# EAGLE design sandh (EAGLE 7.7.0)
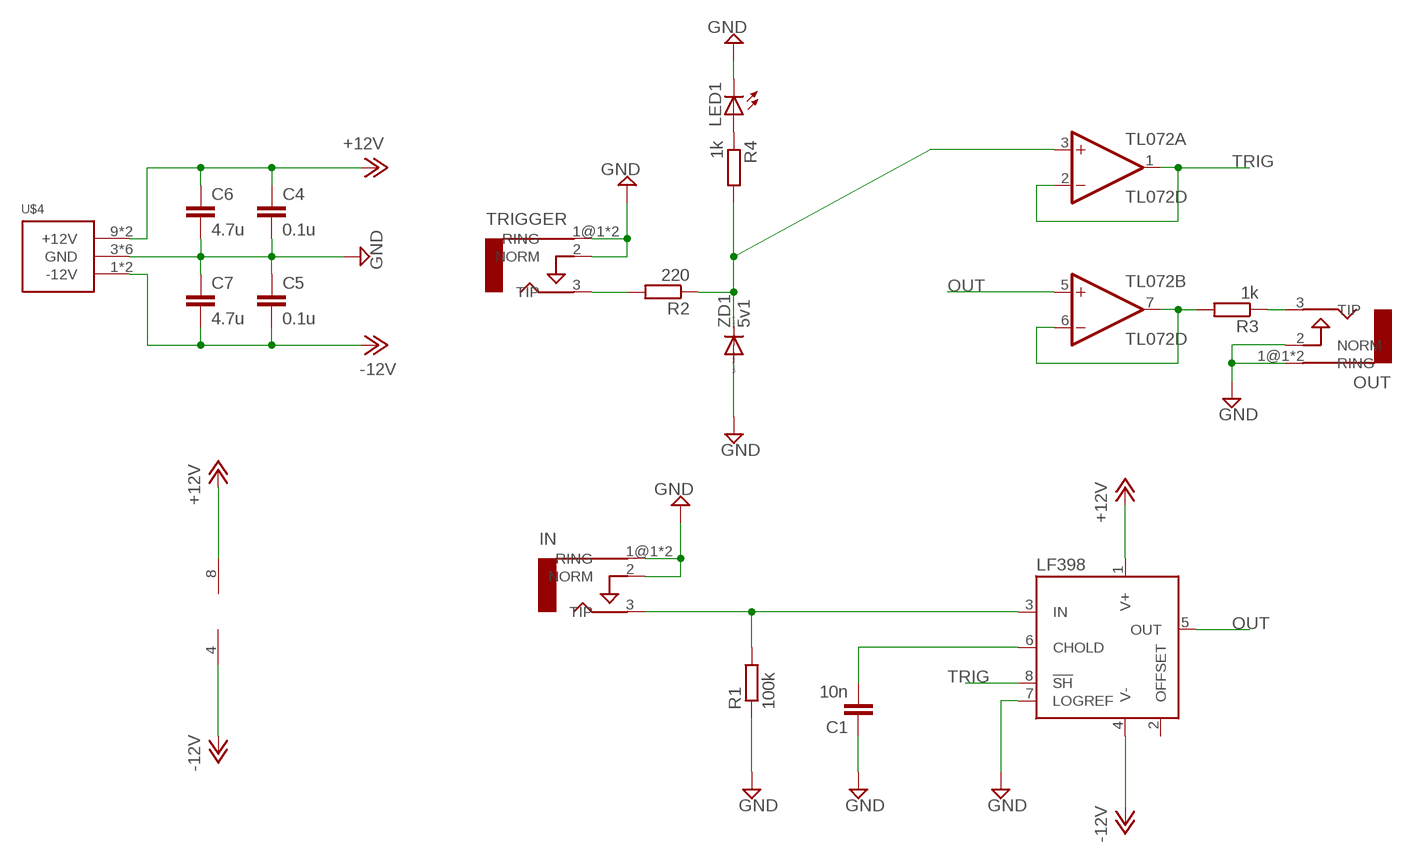
[diagram p0: schematic, sheet 1]

## Parts
C1  10n  C-EUC0805  [C0805]
C4  0.1u  C-EUC0805  [C0805]
C5  0.1u  C-EUC0805  [C0805]
C6  4.7u  C-EUC0805  [C0805]
C7  4.7u  C-EUC0805  [C0805]
IN  AUDIO-JACKERTHENVAR  [ERTHENVAR-JACK]
LED1  LEDCHIP-LED0805  [CHIP-LED0805]
LF398  LF398AD  [SO08]
OUT  AUDIO-JACKERTHENVAR  [ERTHENVAR-JACK]
R1  100k  R-EU_R0805  [R0805]
R2  220  R-EU_R0805  [R0805]
R3  1k  R-EU_R0805  [R0805]
R4  1k  R-EU_R0805  [R0805]
TL072  TL072D  [SO08]
TRIGGER  AUDIO-JACKERTHENVAR  [ERTHENVAR-JACK]
U$4  POWER_SIMPLE10  [POWER_10]
ZD1  5v1  DIODE-SOD323-W  [SOD323-W]

## Nets
+12V: C4.1 C6.1 LF398.1(V+) TL072.8(P:V+) U$4.9(+12V) U$4.10(+12V)
-12V: C5.2 C7.2 LF398.4(V-) TL072.4(P:V-) U$4.1(-12V) U$4.2(-12V)
GND: C1.1 C4.2 C5.1 C6.2 C7.1 IN.1@1(RING) IN.1@2(RING) IN.2(NORM) LED1.C LF398.7(LOGREF) OUT.1@1(RING) OUT.1@2(RING) OUT.2(NORM) R1.1 TRIGGER.1@1(RING) TRIGGER.1@2(RING) TRIGGER.2(NORM) U$4.3(GND) U$4.4(GND) U$4.5(GND) U$4.6(GND) U$4.7(GND) U$4.8(GND) ZD1.A
N$1: IN.3(TIP) LF398.3(IN) R1.2
N$2: C1.2 LF398.6(CHOLD)
N$3: LED1.A R4.1
N$4: R2.2 TRIGGER.3(TIP)
N$5: R3.2 TL072.6(B:-IN) TL072.7(B:OUT)
N$7: OUT.3(TIP) R3.1
OUT: LF398.5(OUT) TL072.5(B:+IN)
TRIG: LF398.8(!SH) R2.1 R4.2 TL072.1(A:OUT) TL072.2(A:-IN) TL072.3(A:+IN) ZD1.C
Unconnected: LF398.2(OFFSET)

## Library data of the parts
C1 C4-C7 = rcl:C-EU: CAPACITOR, European symbol
IN OUT TRIGGER = erthenvar:AUDIO-JACK: Switching Mono 3.5mm Audio Jack from Erthenvar.
LED1 = led:LED: LED OSRAM: - CHIPLED LG R971, LG N971, LY N971, LG Q971, LY Q971, LO R971, LY R971 LH N974, LH R974 LS Q976, LO Q976, LY Q976 LO Q996 - Hyper CHIPLED LW Q18S LB Q993, LB Q99A, LB R99A - SideLED LS A670, LO A670, LY A670, LG A670, LP A670 LB A673, LV A673, LT A673, LW A673 LH A674 LY A675 LS A676, LA A676, LO A676, LY A676, LW A676 LS A679, LY A679, LG A679 - Hyper Micro SIDELED® LS Y876, LA Y876, LO Y876, LY Y876 LT Y87S - SmartLED LW L88C, LW L88S LB L89C, LB L89S, LG L890 LS L89K, LO L89K, LY L89K LS L896, LA L896, LO L896, LY L896 - TOPLED LS T670, LO T670, LY T670, LG T670, LP T670 LSG T670, LSP T670, LSY T670, LOP T670, LYG T670 LG T671, LOG T671, LSG T671 LB T673, LV T673, LT T673, LW T673 LH T674 LS T676, LA T676, LO T676, LY T676, LB T676, LH T676, LSB T676, LW T676 LB T67C, LV T67C, LT T67C, LS T67K, LO T67K, LY T67K, LW E67C LS E67B, LA E67B, LO E67B, LY E67B, LB E67C, LV E67C, LT E67C LW T67C LS T679, LY T679, LG T679 LS T770, LO T770, LY T770, LG T770, LP T770 LB T773, LV T773, LT T773, LW T773 LH T774 LS E675, LA E675, LY E675, LS T675 LS T776, LA T776, LO T776, LY T776, LB T776 LHGB T686 LT T68C, LB T68C - Hyper Mini TOPLED® LB M676 - Mini TOPLED Santana® LG M470 LS M47K, LO M47K, LY M47K Source: http://www.osram.convergy.de LUXEON: - LUMILED® LXK2-PW12-R00, LXK2-PW12-S00, LXK2-PW14-U00, LXK2-PW14-V00 LXK2-PM12-R00, LXK2-PM12-S00, LXK2-PM14-U00 LXK2-PE12-Q00, LXK2-PE12-R00, LXK2-PE12-S00, LXK2-PE14-T00, LXK2-PE14-U00 LXK2-PB12-K00, LXK2-PB12-L00, LXK2-PB12-M00, LXK2-PB14-N00, LXK2-PB14-P00, LXK2-PB14-Q00 LXK2-PR12-L00, LXK2-PR12-M00, LXK2-PR14-Q00, LXK2-PR14-R00 LXK2-PD12-Q00, LXK2-PD12-R00, LXK2-PD12-S00 LXK2-PH12-R00, LXK2-PH12-S00 LXK2-PL12-P00, LXK2-PL12-Q00, LXK2-PL12-R00 Source: www.luxeon.com KINGBRIGHT: KA-3528ASYC Source: www.kingbright.com
LF398 = linear:LF398A: SAMPLE&HOLD AMPLIFIER
R1-R4 = rcl:R-EU_: RESISTOR, European symbol
TL072 = linear:TL072: OP AMP
U$4 = eurorack:POWER_SIMPLE
ZD1 = diode:DIODE-: DIODE

## Board
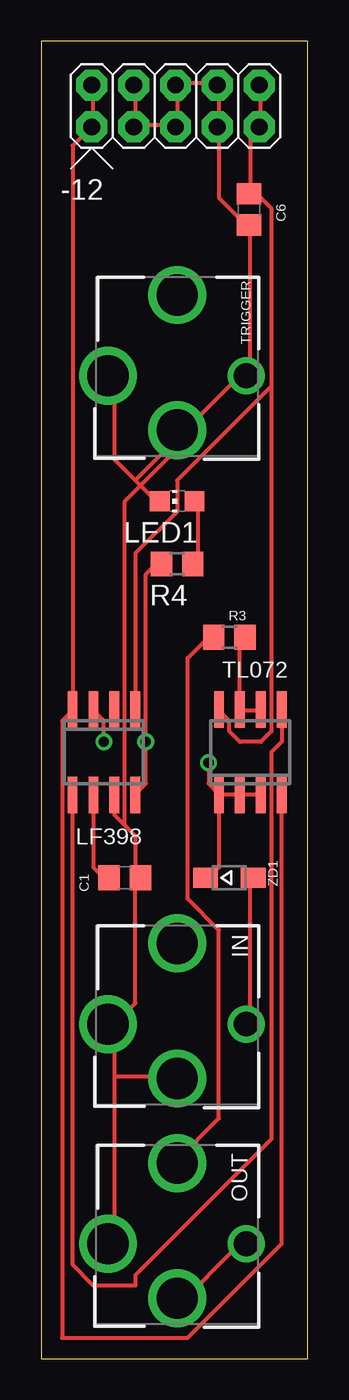
[diagram p1: board, top side]
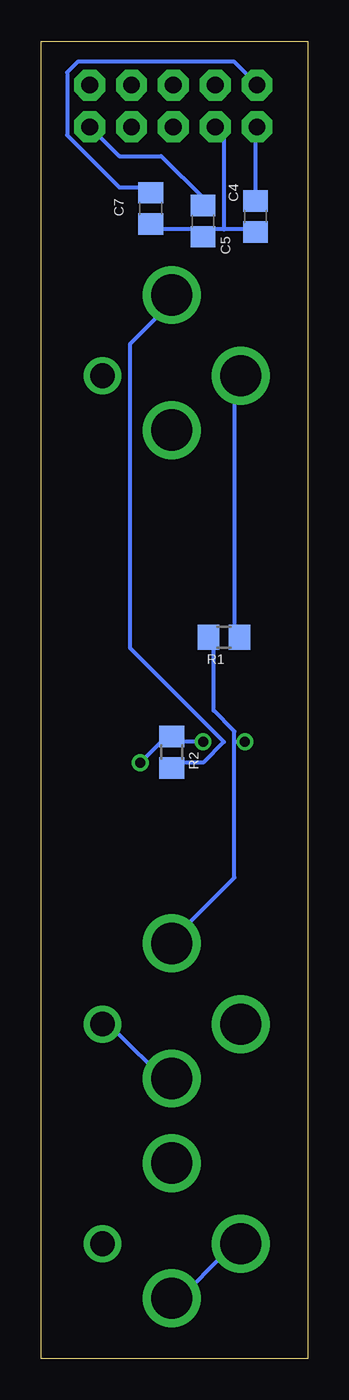
[diagram p2: board, bottom side, seen from below]

Size 16.18 x 80 mm. Coordinates in mm from the lower left corner, seen from the top.
Outline: 0,0 16.18,0 16.18,80 0,80 0,0
Copper layers (1*16): Top 0.035mm / dielectric 1.5mm / Bottom 0.035mm
Design rules "default": minimum track width 10mil, minimum drill 24mil, track to track 8mil, track to pad 8mil, pad to pad 8mil, via to via 8mil, smd to smd 8mil, copper to edge 40mil, drill to drill 8mil, minimum pad ring 10mil, minimum via ring 8mil, stop-mask expansion 4mil, vias tented up to drill 0mil, thermal gap 10mil

### Footprints (pad centres in the part's own frame; a part is rotated, then mirrored left to right if it is on the bottom)
C0805 = smd 1.3 x 1.5: 1 -0.95,0; 2 0.95,0
ERTHENVAR-JACK = drill 2.5: 1@1 -4.2,0; 2 0,-3.3; 3 0,4.9 | drill 1.5: 1@2 4.2,0
CHIP-LED0805 = smd 1.2 x 1.2: A 0,-1.05; C 0,1.05
SO08 = smd 0.6 x 2.2: 1 -1.905,-2.6; 2 -0.635,-2.6; 3 0.635,-2.6; 4 1.905,-2.6; 5 1.905,2.6; 6 0.635,2.6; 7 -0.635,2.6; 8 -1.905,2.6
R0805 = smd 1.3 x 1.5: 1 -0.95,0; 2 0.95,0
POWER_10 = drill 1.016 pad 1.88 octagon: 1 -5.08,-1.27; 2 -5.08,1.27; 3 -2.54,-1.27; 4 -2.54,1.27; 5 0,-1.27; 6 0,1.27; 7 2.54,-1.27; 8 2.54,1.27; 9 5.08,-1.27; 10 5.08,1.27
SOD323-W = smd 1.5 x 1.2: A 1.45,0; C -1.45,0

### Placement (x,y rotation side)
C1  5.08,29.21 180 top
C4  6.35,69.08 270 bottom
C5  3.17,69.35 90 bottom
C6  12.62,69.79 270 top
C7  9.53,69.85 90 bottom
IN  8.26,20.32 0 top
LED1  8.26,52.07 90 top
LF398  3.81,36.83 180 top
OUT  8.26,6.99 0 top
R1  5.08,43.81 180 bottom
R2  8.26,36.83 270 bottom
R3  11.43,43.81 0 top
R4  8.26,48.26 180 top
TL072  12.7,36.83 0 top
TRIGGER  8.26,59.69 0 top
U$4  8.16,76.07 0 top
ZD1  11.43,29.21 0 top

### Tracks (layer width: path | path; a pad name or v marks a point on that pad's centre or on a via)
+12V
  Top 0.254: 12.7,71.12 12.7,74.3 U$4.9 13.34,74.93 13.34,76.83 U$4.10 | LF398.1 5.71,48.9 8.26,51.44 8.26,53.34 13.97,59.05 | 13.97,59.05 13.97,69.85 12.7,71.12 | 12.7,71.12 C6.1 | 13.97,59.05 13.97,38.1 13.34,37.47 12.06,37.47 11.43,38.1 11.43,38.73 10.79,39.37 TL072.8
  Bottom 0.254: C4.1 6.35,70.48 8.89,73.03 11.43,73.03 12.7,74.3 U$4.9
-12V
  Top 0.254: TL072.4 14.61,6.99 8.89,1.27 1.27,1.27 1.27,38.73 1.91,39.37 LF398.4 1.91,73.66 2.54,74.3 U$4.1 3.17,74.93 3.17,76.83 U$4.2
  Bottom 0.254: C7.2 9.53,71.12 11.43,71.12 14.61,74.3 14.61,78.11 13.97,78.74 4.45,78.74 3.17,77.47 U$4.2 | C5.2 3.17,74.3 U$4.1
GND
  Top 0.254: 5.71,74.93 5.71,76.83 U$4.4 | 5.71,74.93 7.62,74.93 U$4.5 8.26,74.93 8.26,76.83 U$4.6 8.26,77.47 10.16,77.47 U$4.8 10.79,76.83 10.79,74.93 U$4.7 10.79,74.3 10.79,70.48 12.06,69.22 C6.2 12.7,68.58 12.7,59.69 TRIGGER.1@2 12.06,59.69 8.26,55.88 | 5.71,74.93 U$4.3 | 5.71,53.34 4.45,54.61 4.45,59.69 TRIGGER.1@1 | 5.71,53.34 6.99,52.07 LED1.C | 5.71,53.34 8.26,55.88 | ZD1.A 12.7,29.21 12.7,20.32 IN.1@2 | OUT.1@2 12.06,6.99 8.26,3.17 OUT.2 | 5.71,29.21 5.71,31.75 5.08,32.38 | 5.08,32.38 4.45,33.02 LF398.7 | 5.71,29.21 5.71,21.59 4.45,20.32 | 5.71,29.21 C1.1 | 4.45,20.32 4.45,17.14 | 4.45,17.14 4.45,6.99 OUT.1@1 | 4.45,20.32 IN.1@1 | 4.45,17.14 8.26,17.14 IN.2 | 8.26,55.88 8.26,55.24 5.08,52.07 5.08,32.38 | 8.26,55.88 TRIGGER.2
  Bottom 0.254: 5.08,68.58 3.17,68.58 C5.1 | 5.08,68.58 6.35,68.58 | 6.35,68.58 9.53,68.58 C7.1 | 6.35,68.58 C4.2 | 5.08,68.58 5.08,74.3 U$4.3 | R1.1 4.45,43.81 4.45,59.69 TRIGGER.1@1 | IN.1@2 12.06,20.32 8.26,16.51 IN.2 | OUT.1@1 4.45,6.99 8.26,3.17 OUT.2
N$1  (via drill 0.61)
  Top 0.254: v3.81,37.47 3.81,38.73 3.17,39.37 LF398.3
  Bottom 0.254: 4.45,37.47 4.45,29.21 8.26,25.4 IN.3 | 4.45,37.47 4.45,38.1 5.71,39.37 5.71,43.81 R1.2 | 4.45,37.47 v3.81,37.47
N$2
  Top 0.254: LF398.6 3.17,29.84 3.81,29.21 C1.2
N$3
  Top 0.254: LED1.A 9.53,52.07 9.53,48.26 R4.1
N$4
  Bottom 0.254: R2.2 8.26,36.2 6.35,36.2 5.08,37.47 10.79,43.18 10.79,61.59 8.26,64.14 TRIGGER.3
N$5
  Top 0.254: R3.2 12.06,43.81 TL072.7 12.06,39.37 13.34,39.37 TL072.6
N$7
  Top 0.254: R3.1 10.16,43.81 8.89,42.55 8.89,27.94 10.79,26.04 10.79,14.61 8.26,12.06 OUT.3
OUT
  Top 0.254: LF398.5 1.91,5.71 3.17,4.45 5.71,4.45 5.71,5.08 13.97,13.34 13.97,36.83 14.61,37.47 TL072.5
TRIG  (via drill 0.61)
  Top 0.254: ZD1.C 10.16,29.21 10.79,29.84 TL072.1 10.79,34.29 | 10.79,34.29 12.06,34.29 | 12.06,34.29 13.34,34.29 TL072.3 | 12.06,34.29 TL072.2 | R4.2 6.99,48.26 6.35,47.62 v6.35,37.47 6.35,34.92 5.71,34.29 LF398.8 | 10.79,34.29 10.16,34.92 v10.16,36.2
  Bottom 0.254: v6.35,37.47 8.26,37.47 R2.1 8.26,38.1 v10.16,36.2